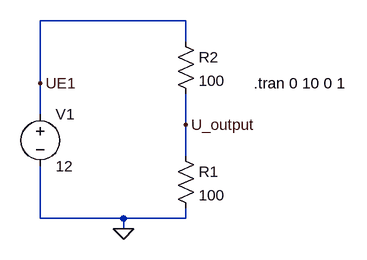
[diagram p0: schematic Pont_diviseur_tension - Ex1.asc]
Pont_diviseur_tension - Ex1.asc, the LTspice schematic file:
Version 4
SHEET 1 880 680
WIRE 256 0 32 0
WIRE 256 32 256 0
WIRE 32 96 32 0
WIRE 32 144 32 96
WIRE 256 160 256 112
WIRE 256 208 256 160
WIRE 32 304 32 224
WIRE 160 304 32 304
WIRE 256 304 256 288
WIRE 256 304 160 304
WIRE 160 320 160 304
FLAG 160 320 0
FLAG 256 160 U_output
FLAG 32 96 UE1
SYMBOL res 240 192 R0
SYMATTR InstName R1
SYMATTR Value 100
SYMBOL res 240 16 R0
SYMATTR InstName R2
SYMATTR Value 100
SYMBOL voltage 32 128 R0
WINDOW 123 0 0 Left 0
WINDOW 39 0 0 Left 0
SYMATTR InstName V1
SYMATTR Value 12
TEXT 360 96 Left 2 !.tran 0 10 0 1

The netlist it stands for:
* Pont_diviseur_tension - Ex1.asc
R1 U_output 0 100
R2 UE1 U_output 100
V1 UE1 0 12
.tran 0 10 0 1
.backanno
.end